# Altium schematic sheet Audio.SchDoc: Ixora
size A3; Organization: Toradex AG; Address1: Altsagenstrasse 5; Address2: Horw; Address3: 6048; Address4: Switzerland; DocumentNumber: 10; Revision: V1.1; SheetNumber: 10; SheetTotal: 19; PageSetup: Record=PageOptions|CenterHorizontal=True|CenterVertical=True|PrintScale=0.73|XCorrection=1.00|YCorrection=1.00|PrintKind=0|BorderSize=5000000|LeftOffset=0|BottomOffset=0|Orientation=2|PaperLength=1000|PaperWidth=1000|Scale=100|PaperSource=7|PrintQuality=-4|MediaType=1|DitherType=10|PaperKind=A4|PrintScaleMode=1
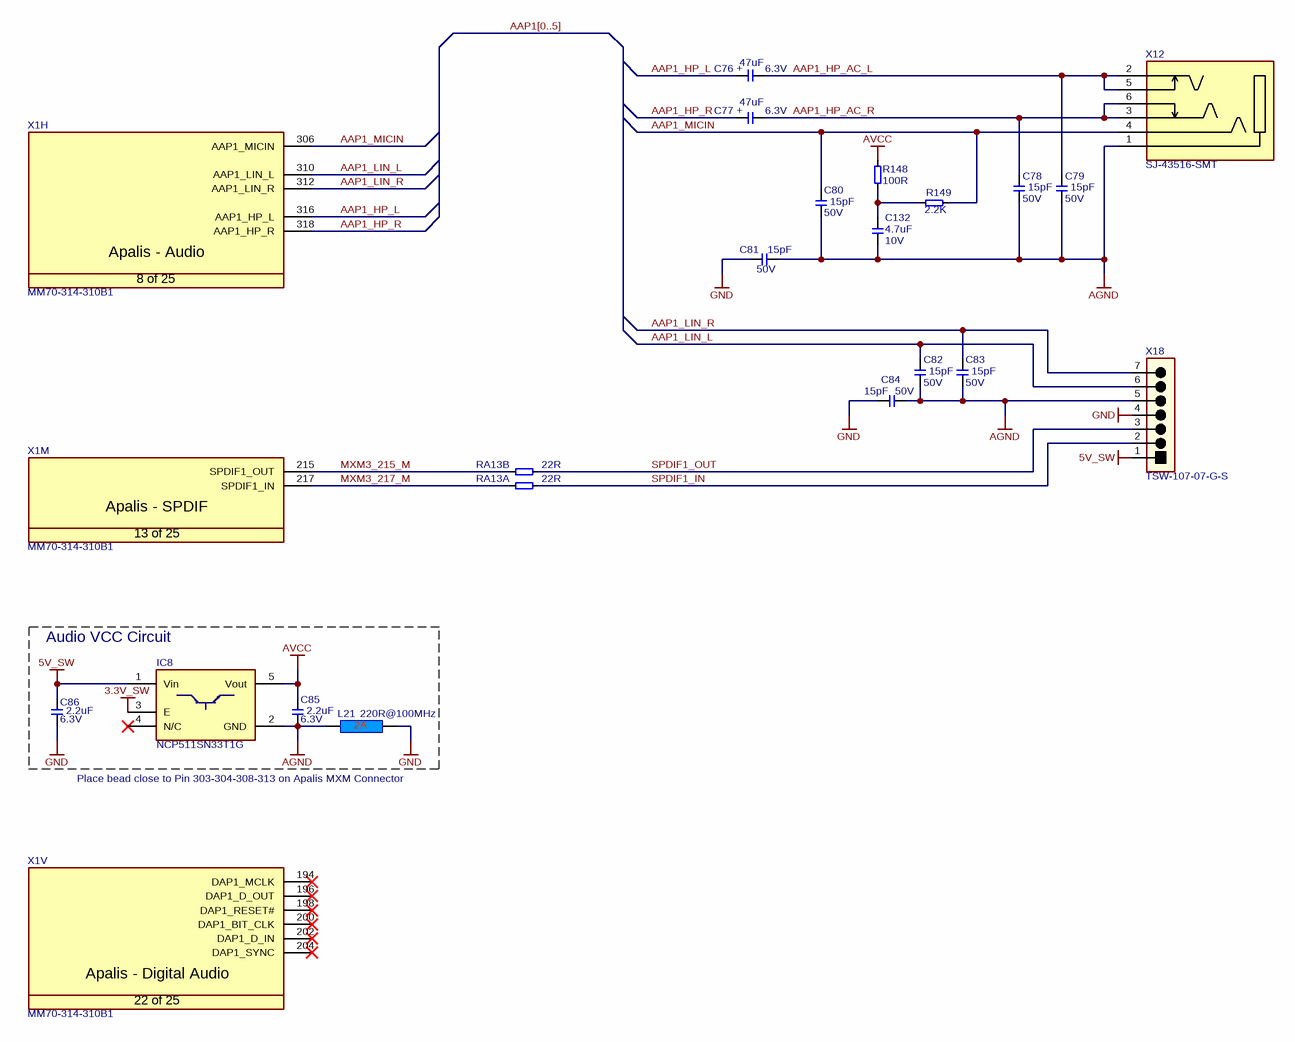
[diagram p0: Audio.SchDoc]

## Parts
C76  Rating: 6.3V  [T_CAPMP3216X180N]  (hidden comment: 47uF)
C77  Rating: 6.3V  [T_CAPMP3216X180N]  (hidden comment: 47uF)
C78  Rating: 50V  [T_CAPC0603X33N]  (hidden comment: 15pF)
C79  Rating: 50V  [T_CAPC0603X33N]  (hidden comment: 15pF)
C80  Rating: 50V  [T_CAPC0603X33N]  (hidden comment: 15pF)
C81  Rating: 50V  [T_CAPC0603X33N]  (hidden comment: 15pF)
C82  Rating: 50V  [T_CAPC0603X33N]  (hidden comment: 15pF)
C83  Rating: 50V  [T_CAPC0603X33N]  (hidden comment: 15pF)
C84  Rating: 50V  [T_CAPC0603X33N]  (hidden comment: 15pF)
C85  Rating: 6.3V  [T_CAPC0603X33N]  (hidden comment: 2.2uF)
C86  Rating: 6.3V  [T_CAPC0603X33N]  (hidden comment: 2.2uF)
C132  Rating: 10V  [T_CAPC0603X33N]  (hidden comment: 4.7uF)
IC8  NCP511SN33T1G  [SOT95P279X142-5N]
L21  220R@100MHz  [INDC1608X95N]
R148  100R  [RESC1005X40N]
R149  2.2K  [RESC1005X40N]
RA13  22R  [T_Resistor_Array_X4]  (parts A,B of 4)
X1  Manufacturer Part No.: MM70-314-310B1  [T_JAE_MM70-314-310B1]  (hidden comment: CON-JAE-MM70-314-310B1-314-0.5mm)  (parts H,M,V of 25)
X12  SJ-43516-SMT  [T_CI_SJ-43516-SMT]
X18  TSW-107-07-G-S  [T_samtech_TSW-107-07-G-S]

## Blocks framed on the sheet
Audio VCC Circuit: C85 C86 IC8 L21

## Nets
3.3V_SW: IC8.3(E)
5V_SW: C86.2 IC8.1(Vin) X18.1
AGND: C78.1 C79.1 C80.1 C81.2 C82.1 C83.1 C84.2 C85.1 C132.2 IC8.2(GND) L21.1 X12.1 X18.5
AVCC: C85.2 IC8.5(Vout) R148.2
GND: C81.1 C84.1 C86.1 L21.2 X18.4
AAP1_HP_AC_L: C76.2 C79.2 X12.2 X12.5
AAP1_HP_AC_R: C77.2 C78.2 X12.3 X12.6
AAP1_HP_L: C76.1 X1.316(AAP1_HP_L)
AAP1_HP_R: C77.1 X1.318(AAP1_HP_R)
AAP1_LIN_L: C82.2 X1.310(AAP1_LIN_L) X18.6
AAP1_LIN_R: C83.2 X1.312(AAP1_LIN_R) X18.7
AAP1_MICIN: C80.2 R149.1 X1.306(AAP1_MICIN) X12.4
MXM3_215_M: RA13.2 X1.215(SPDIF1_OUT)
MXM3_217_M: RA13.1 X1.217(SPDIF1_IN)
SPDIF1_IN: RA13.5 X18.2
SPDIF1_OUT: RA13.6 X18.3
NetC132_1: C132.1 R148.1 R149.2

Not connected (* = marked no-connect by the designer): IC8 4(N/C)*; X1 194(DAP1_MCLK)* 196(DAP1_D_OUT)* 198(DAP1_RESET#)* 200(DAP1_BIT_CLK)* 202(DAP1_D_IN)* 204(DAP1_SYNC)*

## Buses and harness runs
bus AAP1[0..5]

## Notes on the sheet
- Place bead close to Pin 303-304-308-313 on Apalis MXM Connector
- Title
- Size:
- Date:
- A3
- Number:
- Time:
- Revision:
- Sheet
- of
- File:
- (in symbol C-TA-47uF-6.3V-20%-3216) +
- (in symbol CON-JAE-MM70-314-310B1-314-0.5mm, part H) Apalis - Audio; 8 of 25
- (in symbol CON-JAE-MM70-314-310B1-314-0.5mm, part M) Apalis - SPDIF; 13 of 25
- (in symbol CON-JAE-MM70-314-310B1-314-0.5mm, part V) Apalis - Digital Audio; 22 of 25

## Library data of the parts
C76 C77 = C-TA-47uF-6.3V-20%-3216: Capacitor TA 47uF 6.3V 20% 3216; Tolerance: 20%; Type: TA; Value: 47uF
C78-C84 = C-NP0-15pF-50V-10%-0603: Capacitor Ceramic NP0 15pF 50V 10% 0603; Tolerance: 10%; Type: NP0; Value: 15pF
C85 C86 = C-X5R-2.2uF-6.3V-20%-0603: Capacitor Ceramic X5R 2.2uF 6.3V 20% 0603; Tolerance: 20%; Type: X5R; Value: 2.2uF
C132 = C-X5R-4.7uF-10V-10%-0603: Capacitor Ceramic X5R 4.7uF 10V 10% 0603; Tolerance: 10%; Type: X5R; Value: 4.7uF
IC8 = IC-ON-NCP511SN33T1G: NCP511SN33T1G LDO Regulator; Manufacturer Name: ON Semiconductor; Manufacturer Part No.: NCP511SN33T1G
L21 = L-220R@100MHz-2A-25%-0603: 220R@100MHz 2A EMI FILTER; Tolerance: 25%; Rating: 2A; Value: 220R@100MHz
R148 = R-100R-63mW-5%-0402: Resistor 100 ohm 63mW 5% 0402; Rating: 63mW; Tolerance: 5%; Value: 100R
R149 = R-2.2KR-63mW-5%-0402: Resistor 2.2Kohm 63mW 5% 0402; Value: 2.2KR; Rating: 63mW; Tolerance: 5%
RA13 = RA-22R-63mW-5%-1206-div: Resistor Array 22 R 63mW 5% 1206; Tolerance: 5%; Power Dissipation: 63mW; Value: 22R
X1 = CON-JAE-MM70-314-310B1-314-0.5mm: MXM3 Connector; Manufacturer Name: JAE; No. of ways: 314
X12 = CON-Cui-SJ-43516-SMT-6-3.5mm: 3.5mm Stereo Jack SMD With Detect Contact; Manufacturer Name: Cui INC; No. of ways: 6; Manufacturer Part No.: SJ-43516-SMT
X18 = CON-Samtec-TSW-107-07-G-S: Header male, 1X7 Pins, 2.54 mm pitch; Manufacturer Name: Samtec; Pitch: 2.54 mm; No. of ways: 1X7; Manufacturer Part No.: TSW-107-07-G-S